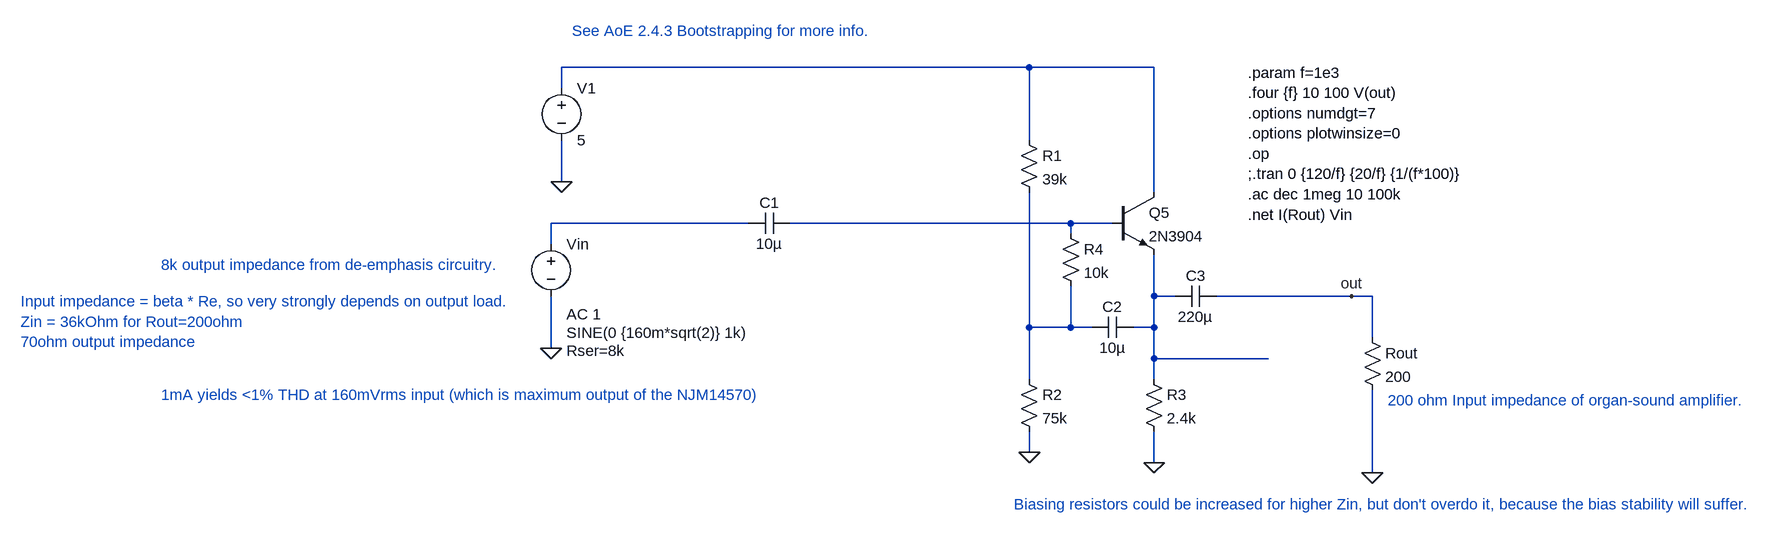
[diagram p0: schematic amp1.asc]
amp1.asc, the LTspice schematic file:
Version 4
SHEET 1 1384 688
WIRE 32 0 -688 0
WIRE 224 0 32 0
WIRE -688 32 -688 0
WIRE 32 112 32 0
WIRE -688 176 -688 112
WIRE 224 192 224 0
WIRE -400 240 -704 240
WIRE 96 240 -336 240
WIRE 160 240 96 240
WIRE 96 256 96 240
WIRE -704 272 -704 240
WIRE 224 352 224 288
WIRE 256 352 224 352
WIRE 528 352 320 352
WIRE 560 352 528 352
WIRE 32 400 32 192
WIRE 96 400 96 336
WIRE 96 400 32 400
WIRE 128 400 96 400
WIRE 224 400 224 352
WIRE 224 400 192 400
WIRE 560 416 560 352
WIRE -704 432 -704 352
WIRE 224 448 224 400
WIRE 400 448 224 448
WIRE 32 480 32 400
WIRE 224 480 224 448
WIRE 32 592 32 560
WIRE 224 608 224 560
WIRE 560 624 560 496
FLAG -688 176 0
FLAG -704 432 0
FLAG 560 624 0
FLAG 528 352 out
FLAG 224 608 0
FLAG 32 592 0
DATAFLAG 304 448 ""
SYMBOL voltage -688 16 R0
SYMATTR InstName V1
SYMATTR Value 5
SYMBOL cap -336 224 R90
WINDOW 0 0 32 VBottom 2
WINDOW 3 32 32 VTop 2
SYMATTR InstName C1
SYMATTR Value 10µ
SYMBOL voltage -704 256 R0
WINDOW 3 24 152 Left 2
WINDOW 123 24 124 Left 2
WINDOW 39 24 180 Left 2
SYMATTR Value SINE(0 {160m*sqrt(2)} 1k)
SYMATTR Value2 AC 1
SYMATTR SpiceLine Rser=8k
SYMATTR InstName Vin
SYMBOL npn 160 192 R0
SYMATTR InstName Q5
SYMATTR Value 2N3904
SYMBOL cap 320 336 R90
WINDOW 0 0 32 VBottom 2
WINDOW 3 32 32 VTop 2
SYMATTR InstName C3
SYMATTR Value 220µ
SYMBOL res 544 400 R0
SYMATTR InstName Rout
SYMATTR Value 200
SYMBOL res 16 96 R0
SYMATTR InstName R1
SYMATTR Value 39k
SYMBOL res 16 464 R0
SYMATTR InstName R2
SYMATTR Value 75k
SYMBOL res 208 464 R0
SYMATTR InstName R3
SYMATTR Value 2.4k
SYMBOL res 80 240 R0
SYMATTR InstName R4
SYMATTR Value 10k
SYMBOL cap 192 384 R90
WINDOW 0 0 32 VBottom 2
WINDOW 3 32 32 VTop 2
SYMATTR InstName C2
SYMATTR Value 10µ
TEXT 368 8 Left 2 !.param f=1e3\n.four {f} 10 100 V(out)\n.options numdgt=7\n.options plotwinsize=0\n.op\n;.tran 0 {120/f} {20/f} {1/(f*100)}\n.ac dec 1meg 10 100k\n.net I(Rout) Vin
TEXT -1304 304 Left 2 ;8k output impedance from de-emphasis circuitry.
TEXT 584 512 Left 2 ;200 ohm Input impedance of organ-sound amplifier.
TEXT -1520 360 Left 2 ;Input impedance = beta * Re, so very strongly depends on output load.\nZin = 36kOhm for Rout=200ohm\n70ohm output impedance
TEXT -672 -56 Left 2 ;See AoE 2.4.3 Bootstrapping for more info.
TEXT -1304 504 Left 2 ;1mA yields <1% THD at 160mVrms input (which is maximum output of the NJM14570)
TEXT 8 672 Left 2 ;Biasing resistors could be increased for higher Zin, but don't overdo it, because the bias stability will suffer.

The netlist it stands for:
* amp1.asc
V1 N001 0 5
C1 N003 N002 10µ
Vin N002 0 SINE(0 {160m*sqrt(2)} 1k) AC 1 Rser=8k
Q5 N001 N003 N004 0 2N3904
C3 out N004 220µ
Rout out 0 200
R1 N001 N005 39k
R2 N005 0 75k
R3 N004 0 2.4k
R4 N003 N005 10k
C2 N004 N005 10µ
.model NPN NPN
.model PNP PNP
.lib standard.bjt
.param f=1e3
.four {f} 10 100 V(out)
.options numdgt=7
.options plotwinsize=0
.op
;.tran 0 {120/f} {20/f} {1/(f*100)}
.ac dec 1meg 10 100k
.net I(Rout) Vin
* 8k output impedance from de-emphasis circuitry.
* 200 ohm Input impedance of organ-sound amplifier.
* Input impedance = beta * Re, so very strongly depends on output load.
* Zin = 36kOhm for Rout=200ohm
* 70ohm output impedance
* See AoE 2.4.3 Bootstrapping for more info.
* 1mA yields <1% THD at 160mVrms input (which is maximum output of the NJM14570)
* Biasing resistors could be increased for higher Zin, but don't overdo it, because the bias stability will suffer.
.backanno
.end